# Altium project PCB_Project.PrjPCB
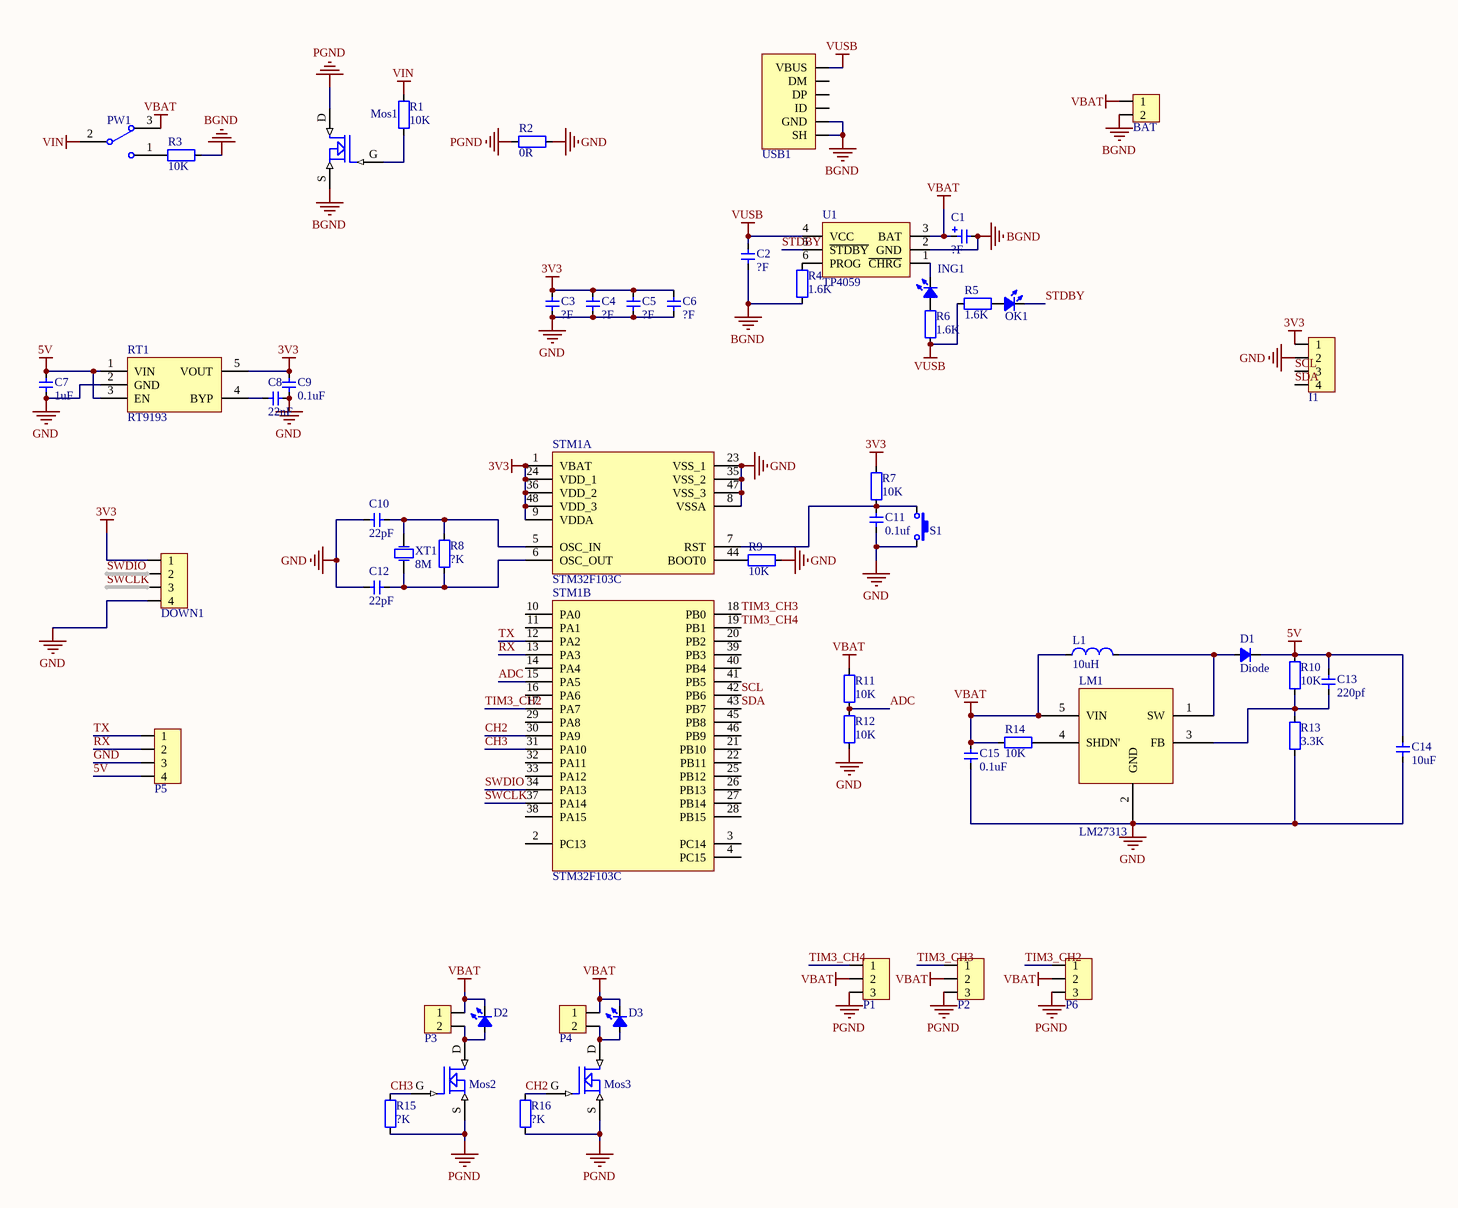
[diagram p0: micro_flight.SchDoc]
1 sheet, 57 parts. Net scope: global (net labels, ports and power ports of the same name join across sheets).
Board file: PCB.PcbDoc

## Sheet micro_flight.SchDoc
size A3

### Parts
BAT  HDR1x2_2.54  [HDR1X2_2.54_90]  (value not drawn)
C1  value ?F  [CAP_TAN_D2917]  (hidden comment: Cap_Tan_2917)
C2  value ?F  [CAP_0805]  (hidden comment: Cap_0805)
C3  value ?F  [CAP_0805]  (hidden comment: Cap_0805)
C4  value ?F  [CAP_0805]  (hidden comment: Cap_0805)
C5  value ?F  [CAP_0805]  (hidden comment: Cap_0805)
C6  value ?F  [CAP_0805]  (hidden comment: Cap_0805)
C7  value 1uF  [CAP_0805]  (hidden comment: Cap_0805)
C8  value 22nF  [CAP_0805]  (hidden comment: Cap_0805)
C9  value 0.1uF  [CAP_0805]  (hidden comment: Cap_0805)
C10  value 22pF  [CAP_0805]  (hidden comment: Cap_0805)
C11  value 0.1uf  [CAP_0805]  (hidden comment: Cap_0805)
C12  value 22pF  [CAP_0805]  (hidden comment: Cap_0805)
C13  value 220pf  [CAP_0805]  (hidden comment: Cap_0805)
C14  value 10uF  [CAP_0805]  (hidden comment: Cap_0805)
C15  value 0.1uF  [CAP_0805]  (hidden comment: Cap_0805)
D1  Diode  [LED_0805_RED]
D2  LED_0805  [LED_0805_RED]  (value not drawn)
D3  LED_0805  [LED_0805_RED]  (value not drawn)
DOWN1  HDR1x4_2.54  [HDR1x4_2.54_180]  (value not drawn)
I1  HDR1x4_2.54  [HDR1x4_2.54_180]  (value not drawn)
ING1  LED_0805  [LED_0805_RED]  (value not drawn)
L1  value 10uH  [IND_CD32]  (hidden comment: Ind_CD32)
LM1  LM27313  [SOT23-5]
Mos1  MOSFET N  [Nmos_SOT23]  (value not drawn)
Mos2  MOSFET N  [Nmos_SOT23]  (value not drawn)
Mos3  MOSFET N  [Nmos_SOT23]  (value not drawn)
OK1  LED_0805  [LED_0805_GREEN]  (value not drawn)
P1  HDR1x3_2.54  [HDR1X3_2.54_180]  (value not drawn)
P2  HDR1x3_2.54  [HDR1X3_2.54_180]  (value not drawn)
P3  HDR1x2_2.54  [HDR1X2_2.54_180]  (value not drawn)
P4  HDR1x2_2.54  [HDR1X2_2.54_180]  (value not drawn)
P5  HDR1x4_2.54  [HDR1x4_2.54_180]  (value not drawn)
P6  HDR1x3_2.54  [HDR1X3_2.54_180]  (value not drawn)
PW1  SwitchSPDT_2.8x6.6_90  [SwitchSPDT_2.8X6.6_90]  (value not drawn)
R1  value 10K  [RES_0805]  (hidden comment: Res_0805)
R2  value 0R  [RES_0805]  (hidden comment: Res_0805)
R3  value 10K  [RES_0805]  (hidden comment: Res_0805)
R4  value 1.6K  [RES_0805]  (hidden comment: Res_0805)
R5  value 1.6K  [RES_0805]  (hidden comment: Res_0805)
R6  value 1.6K  [RES_0805]  (hidden comment: Res_0805)
R7  value 10K  [RES_0805]  (hidden comment: Res_0805)
R8  value ?K  [RES_0805]  (hidden comment: Res_0805)
R9  value 10K  [RES_0805]  (hidden comment: Res_0805)
R10  value 10K  [RES_0805]  (hidden comment: Res_0805)
R11  value 10K  [RES_0805]  (hidden comment: Res_0805)
R12  value 10K  [RES_0805]  (hidden comment: Res_0805)
R13  value 3.3K  [RES_0805]  (hidden comment: Res_0805)
R14  value 10K  [RES_0805]  (hidden comment: Res_0805)
R15  value ?K  [RES_0805]  (hidden comment: Res_0805)
R16  value ?K  [RES_0805]  (hidden comment: Res_0805)
RT1  RT9193  [SOT23-5]
S1  ButtonTACT_3x6x2.5_180  [ButtonTACT_3x6x2.5_180]  (value not drawn)
STM1  STM32F103C  [LQFP_P0.5_48]  (parts A,B of 2)
U1  TP4059  [SOT23-6]
USB1  USB_Micro  [USB_Micro-AB]  (value not drawn)
XT1  value 8M  [XT_5032_2]  (hidden comment: XTAL_5032_2P)

### Nets
3V3: C3.2 C4.2 C5.2 C6.2 C9.2 DOWN1.1 I1.1 R7.2 RT1.5(VOUT) STM1.1(VBAT) STM1.9(VDDA) STM1.24(VDD_1) STM1.36(VDD_2) STM1.48(VDD_3)
5V: C7.2 C13.2 C14.2 D1.2(K) P5.4 R10.2 RT1.1(VIN) RT1.3(EN)
BGND: BAT.2 C1.2 C2.1 Mos1.S R3.1 R4.1 U1.2(GND) USB1.0(SH) USB1.5(GND)
GND: C3.1 C4.1 C5.1 C6.1 C7.1 C8.2 C9.1 C10.1 C11.1 C12.1 C14.1 C15.1 DOWN1.4 I1.2 LM1.2(GND) P5.3 R2.1 R9.2 R12.1 R13.1 RT1.2(GND) S1.2 STM1.8(VSSA) STM1.23(VSS_1) STM1.35(VSS_2) STM1.47(VSS_3)
PGND: Mos1.D Mos2.S Mos3.S P1.3 P2.3 P6.3 R2.2 R15.2 R16.2
VBAT: BAT.1 C1.1 C15.2 D2.2(K) D3.2(K) L1.1 LM1.5(VIN) P1.2 P2.2 P3.1 P4.1 P6.2 PW1.3 R11.1 R14.2 U1.3(BAT)
VIN: PW1.2 R1.2
VUSB: C2.2 R5.2 R6.1 U1.4(VCC) USB1.1(VBUS)
ADC: R11.2 R12.2 STM1.15(PA5)
CH2: Mos3.G R16.1 STM1.30(PA9)
CH3: Mos2.G R15.1 STM1.31(PA10)
RX: P5.2 STM1.13(PA3)
SCL: I1.3 STM1.42(PB6)
SDA: I1.4 STM1.43(PB7)
STDBY: OK1.2(K) U1.5(~{STDBY})
SWCLK: DOWN1.3 STM1.37(PA14)
SWDIO: DOWN1.2 STM1.34(PA13)
TIM3_CH2: P6.1 STM1.17(PA7)
TIM3_CH3: P2.1 STM1.18(PB0)
TIM3_CH4: P1.1 STM1.19(PB1)
TX: P5.1 STM1.12(PA2)
NetC8_1: C8.1 RT1.4(BYP)
NetC10_2: C10.2 R8.2 STM1.5(OSC_IN) XT1.2(OSC2)
NetC11_2: C11.2 R7.1 S1.1 STM1.7(RST)
NetC12_2: C12.2 R8.1 STM1.6(OSC_OUT) XT1.1(OSC1)
NetC13_1: C13.1 LM1.3(FB) R10.1 R13.2
NetD1_1: D1.1(A) L1.2 LM1.1(SW)
NetD2_1: D2.1(A) Mos2.D P3.2
NetD3_1: D3.1(A) Mos3.D P4.2
NetING1_1: ING1.1(A) R6.2
NetING1_2: ING1.2(K) U1.1(~{CHRG})
NetLM1_4: LM1.4(SHDN') R14.1
NetMos1_G: Mos1.G R1.1
NetOK1_1: OK1.1(A) R5.1
NetPW1_1: PW1.1 R3.2
NetR4_2: R4.2 U1.6(PROG)
NetR9_1: R9.1 STM1.44(BOOT0)

Not connected (* = marked no-connect by the designer): STM1 2(PC13) 3(PC14) 4(PC15) 10(PA0) 11(PA1) 14(PA4) 16(PA6) 20(PB2) 21(PB10) 22(PB11) 25(PB12) 26(PB13) 27(PB14) 28(PB15) 29(PA8) 32(PA11) 33(PA12) 38(PA15) 39(PB3) 40(PB4) 41(PB5) 45(PB8) 46(PB9); USB1 2(DM) 3(DP) 4(ID)

### Library data of the parts
BAT = HDR1x2_2.54: Header
C1 = Cap_Tan_2917: Capacitor
C2-C15 = Cap_0805: Capacitor
D2 D3 ING1 OK1 = LED_0805: LED
DOWN1 I1 P5 = HDR1x4_2.54: Header
L1 = Ind_CD32: Inductor
Mos1-Mos3 = MOSFET N: MOS SOT23
P1 P2 P6 = HDR1x3_2.54: Header
P3 P4 = HDR1x2_2.54T: Header
PW1 = SwitchSPDT_2.8x6.6_90: Switch
R1-R16 = Res_0805: Resistor
RT1 = RT9193: Power
S1 = ButtonTACT_3x6x2.5_180: Button
STM1 = STM32F103C: MCU
USB1 = USB_Micro: USB
XT1 = XTAL_5032_2P: Crystal Oscillator